# Altium project hardware.PrjPcb
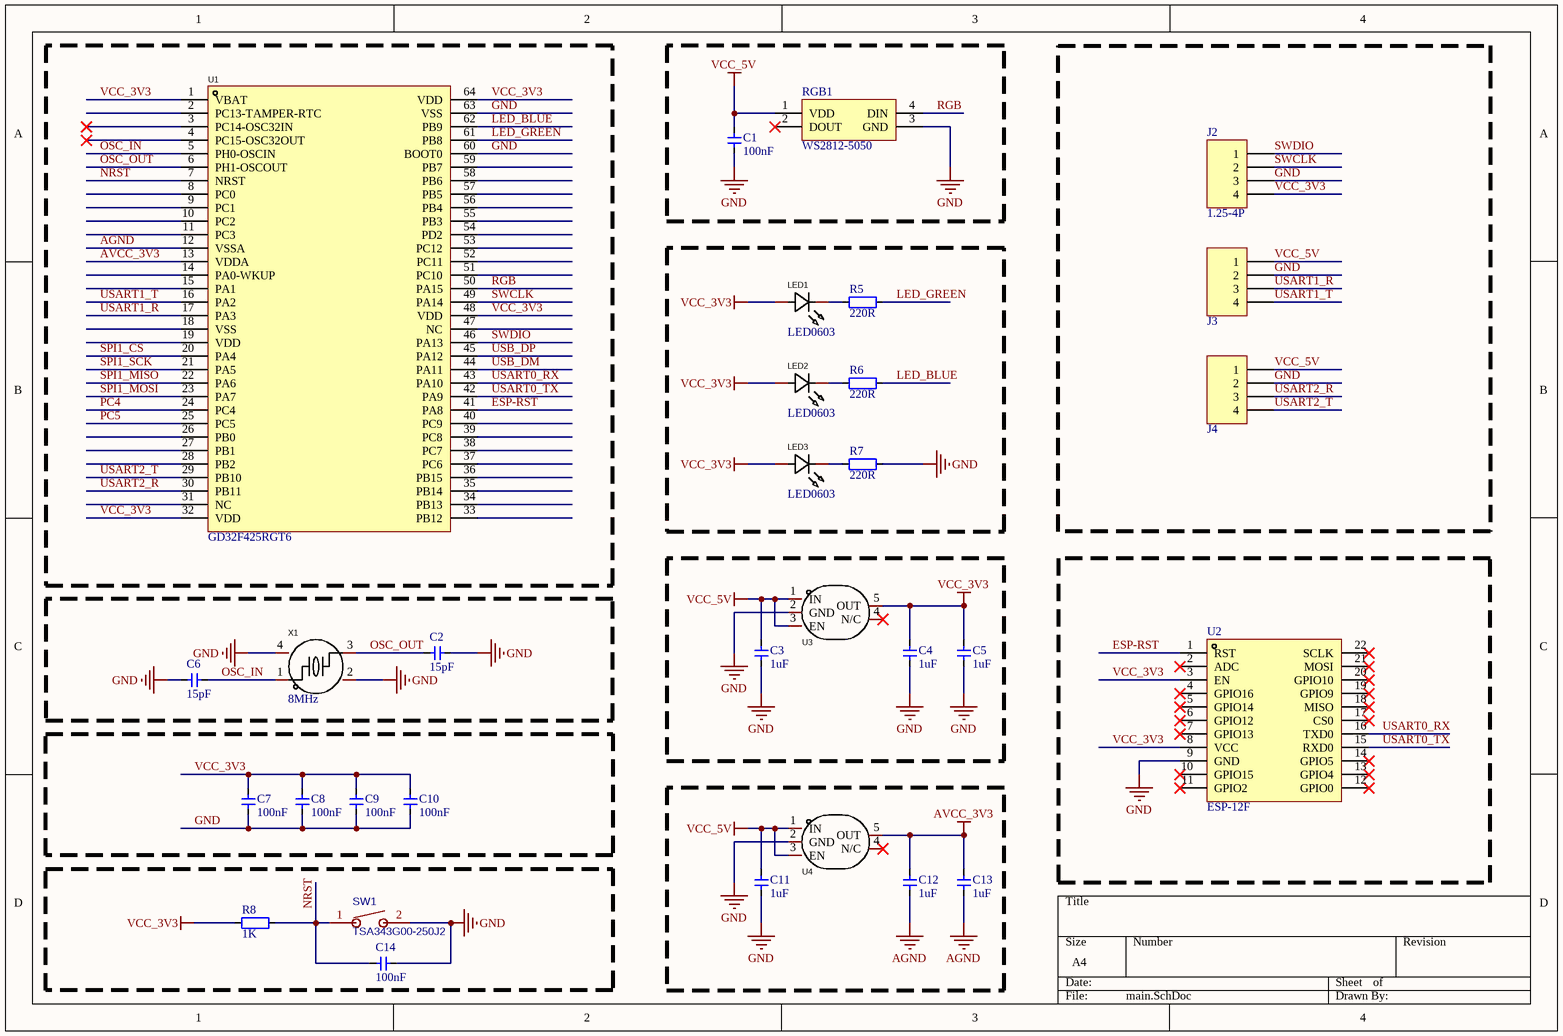
[diagram p0: main.SchDoc]
3 sheets, 65 parts. Net scope: global (net labels, ports and power ports of the same name join across sheets).
Board file: main.PcbDoc
Sheets:
  main.SchDoc
  interface.SchDoc
  w5500.SchDoc

## Sheet main.SchDoc
size A4

### Parts
C1  100nF  [C0603]
C2  15pF  [C0603]
C3  1uF  [C0603]
C4  1uF  [C0603]
C5  1uF  [C0603]
C6  15pF  [C0603]
C7  100nF  [C0603]
C8  100nF  [C0603]
C9  100nF  [C0603]
C10  100nF  [C0603]
C11  1uF  [C0603]
C12  1uF  [C0603]
C13  1uF  [C0603]
C14  100nF  [C0603]
J2  1.25-4P  [CONN-SMD_1.25-4PWT]
J3  GH1.25-W-4P  [CONN-SMD_4P-P1.25_X1251WRS-04HF-LPSW]  (value not drawn)
J4  GH1.25-W-4P  [CONN-SMD_4P-P1.25_X1251WRS-04HF-LPSW]  (value not drawn)
LED1  LED0603  [LED0603-BLUE]
LED2  LED0603  [LED0603-BLUE]
LED3  LED0603  [LED0603-BLUE]
R5  220R  [R0603]
R6  220R  [R0603]
R7  220R  [R0603]
R8  1K  [R0603]
RGB1  WS2812-5050  [LED-SMD_4P-L5.0-W5.0-TL_WS2812B-B]
SW1  TSA343G00-250J2  [SW-SMD_L4.0-W2.9-LS5.0]
U1  GD32F425RGT6  [LQFP-64_L10.0-W10.0-P0.50-LS12.0-BL - duplicate]
U2  ESP-12F  [WIFIM-SMD_ESP-12F-ESP8266MOD]
U3  LP5907  [SOT-23-5_L2.9-W1.6-P0.95-LS2.8-BR]  (value not drawn)
U4  LP5907  [SOT-23-5_L2.9-W1.6-P0.95-LS2.8-BR]  (value not drawn)
X1  8MHz  [CRYSTAL-SMD_4P-L3.2-W2.5-BL-1]

### Nets
AGND: C12.1 C13.1 U1.12(VSSA)
AVCC_3V3: C12.2 C13.2 U1.13(VDDA) U4.5(OUT)
GND: C1.1 C2.2 C3.1 C4.1 C5.1 C6.1 C7.1 C8.1 C9.1 C10.1 C11.1 C14.2 J2.3 J3.2 J4.2 R7.2 RGB1.3(GND) SW1.2 U1.60(BOOT0) U1.63(VSS) U2.9(GND) U3.2(GND) U4.2(GND) X1.2(GND) X1.4(GND)
VCC_3V3: C4.2 C5.2 C7.2 C8.2 C9.2 C10.2 J2.4 LED1.2(A) LED2.2(A) LED3.2(A) R8.1 U1.1(VBAT) U1.32(VDD) U1.48(VDD) U1.64(VDD) U2.3(EN) U2.8(VCC) U3.5(OUT)
VCC_5V: C1.2 C3.2 C11.2 J3.1 J4.1 RGB1.1(VDD) U3.1(IN) U3.3(EN) U4.1(IN) U4.3(EN)
ESP-RST: U1.41(PA8) U2.1(RST)
LED_BLUE: R6.2 U1.62(PB9)
LED_GREEN: R5.2 U1.61(PB8)
NRST: C14.1 R8.2 SW1.1 U1.7(NRST)
OSC_IN: C6.2 U1.5(PH0-OSCIN) X1.1
OSC_OUT: C2.1 U1.6(PH1-OSCOUT) X1.3
PC4: U1.24(PC4)
PC5: U1.25(PC5)
RGB: RGB1.4(DIN) U1.50(PA15)
SPI1_CS: U1.20(PA4)
SPI1_MISO: U1.22(PA6)
SPI1_MOSI: U1.23(PA7)
SPI1_SCK: U1.21(PA5)
SWCLK: J2.2 U1.49(PA14)
SWDIO: J2.1 U1.46(PA13)
USART0_RX: U1.43(PA10) U2.16(TXD0)
USART0_TX: U1.42(PA9) U2.15(RXD0)
USART1_R: J3.3 U1.17(PA3)
USART1_T: J3.4 U1.16(PA2)
USART2_R: J4.3 U1.30(PB11)
USART2_T: J4.4 U1.29(PB10)
USB_DM: U1.44(PA11)
USB_DP: U1.45(PA12)
NetLED1_1: LED1.1(K) R5.1
NetLED2_1: LED2.1(K) R6.1
NetLED3_1: LED3.1(K) R7.1

Not connected (* = marked no-connect by the designer): RGB1 2(DOUT)*; U1 2(PC13-TAMPER-RTC) 3(PC14-OSC32IN)* 4(PC15-OSC32OUT)* 8(PC0) 9(PC1) 10(PC2) 11(PC3) 14(PA0-WKUP) 15(PA1) 18(VSS) 19(VDD) 26(PB0) 27(PB1) 28(PB2) 31(NC) 33(PB12) 34(PB13) 35(PB14) 36(PB15) 37(PC6) 38(PC7) 39(PC8) 40(PC9) 47(NC) 51(PC10) 52(PC11) 53(PC12) 54(PD2) 55(PB3) 56(PB4) 57(PB5) 58(PB6) 59(PB7); U2 2(ADC)* 4(GPIO16)* 5(GPIO14)* 6(GPIO12)* 7(GPIO13)* 10(GPIO15)* 11(GPIO2)* 12(GPIO0)* 13(GPIO4)* 14(GPIO5)* 17(CS0)* 18(MISO)* 19(GPIO9)* 20(GPIO10)* 21(MOSI)* 22(SCLK)*; U3 4(N/C)*; U4 4(N/C)*

### Library data of the parts
C1-C14 = C0603
J2 = A1.25-4P
LED1-LED3 = LED0603: Manufacturer: VISHAY(威世); Name: VLMTG1401-GS08; Add into BOM: yes; Symbol: VLMTG1401-GS08; Device: VLMTG1401-GS08; LCSC Part Name: VLMTG1401-GS08; Supplier Part: C511604; Manufacturer Part: VLMTG1401-GS08; Supplier Footprint: 0603; JLCPCB Part Class: Extended Part; Datasheet: https://atta.szlcsc.com/upload/public/pdf/source/20200413/C511604_272E80EA2E53340B96FA7453D68B4387.pdf; Supplier: LCSC; Convert to PCB: yes; Mounting Type: -; Illumination Color: -; Lens Color: -; Correlated Color Temperature - CCT(K): -; Luminous Intensity (IF=20mA): -; Luminous Flux/Radiant Flux: -; Color Rendering Index(CRI): -; Dominant Wavelength / Coordinate rank: -; Vf - Forward Voltage: -; Size / Dimension: -; Operating Temperature: -; Height (Max): -
R5-R8 = R0603
SW1 = TSA343G00-250J2: 贴片轻触开关; BOM_Manufacturer: BRIGHT; Contributor: LCSC; BOM_Supplier: LCSC; BOM_Supplier Part: C354946; BOM_Manufacturer Part: TSA343G00-250J2; spicePre: S; spiceSymbolName: TSA343G00-250J2
U1 = GD32F425RGT6: Manufacturer: GigaDevice(兆易创新); Symbol: GD32F425RGT6_C5110337; Add into BOM: yes; CPU Core: ARM Cortex-M4; CPU Maximum Speed: 200MHz; Program Storage Size: 1MB; Program Memory Type: FLASH; RAM Size: 256KB; GPIO Ports Number: 51; ADC (Bit): 12bit; 16Bit Timer: 12; 32Bit Timer: 2; UART/USART: 6; I2C: 3; Universal Serial Bus: 有; Peripheral/Function: 看门狗；SDIO；RTC实时时钟; Name: GD32F425RGT6; Device: GD32F425RGT6_C5110337; LCSC Part Name: ARM Cortex-M4 200MHz; Supplier Part: C5110337; Manufacturer Part: GD32F425RGT6; Supplier Footprint: LQFP-64(10x10); JLCPCB Part Class: Extended Part; Datasheet: https://atta.szlcsc.com/upload/public/pdf/source/20220714/13D48AB36408F15A7501F309CB28955F.pdf; Supplier: LCSC; Convert to PCB: yes; Operating Voltage Range: -; EEPROM: -; DAC (Bit): 12bit; PWM (Bit): -; 8Bit Timer: -; CAN: 2; I2S: 2; SPI: 3; Internal Comparator: -; communication protocol: -; Watchdog: 有; Real-Time Clock: 有; Infrared Data Association: -; Low-Voltage Detect: -; CCP Capture/Compare: -; Secure Digital Input and Output: 有; Direct Memory Access: -; Internal Oscillator: -; Operating Temperature Range: -
U3 U4 = LP5907: Manufacturer: TI(德州仪器); Name: LP5907MFX-3.2/NOPB; Add into BOM: yes; Symbol: LP5907MFX-3.2/NOPB; Device: LP5907MFX-3.2/NOPB; LCSC Part Name: LP5907MFX-3.2/NOPB; Supplier Part: C2832238; Manufacturer Part: LP5907MFX-3.2/NOPB; Supplier Footprint: SOT-23-5; JLCPCB Part Class: Extended Part; Datasheet: https://atta.szlcsc.com/upload/public/pdf/source/20230221/5933F7A77801C34991E6DC8A51DC8D54.pdf; Supplier: LCSC; Convert to PCB: yes; Output Type: -
X1 = 8Mhz: Manufacturer: CJ(江苏长电/长晶); Symbol: CJ13-080001210C30; Add into BOM: yes; Load Capacitance: 12pF; Name: 8MHz; Device: CJ13-080001210C30; LCSC Part Name: 8MHz 12pF; Supplier Part: C2875275; Manufacturer Part: CJ13-080001210C30; Supplier Footprint: SMD3225-4P; JLCPCB Part Class: Extended Part; Datasheet: https://atta.szlcsc.com/upload/public/pdf/source/20211013/0FAD337EB33B5BE9D660099A731DCCD1.pdf; Supplier: LCSC; Convert to PCB: yes; Value: 8MHz

## Sheet interface.SchDoc
size A4
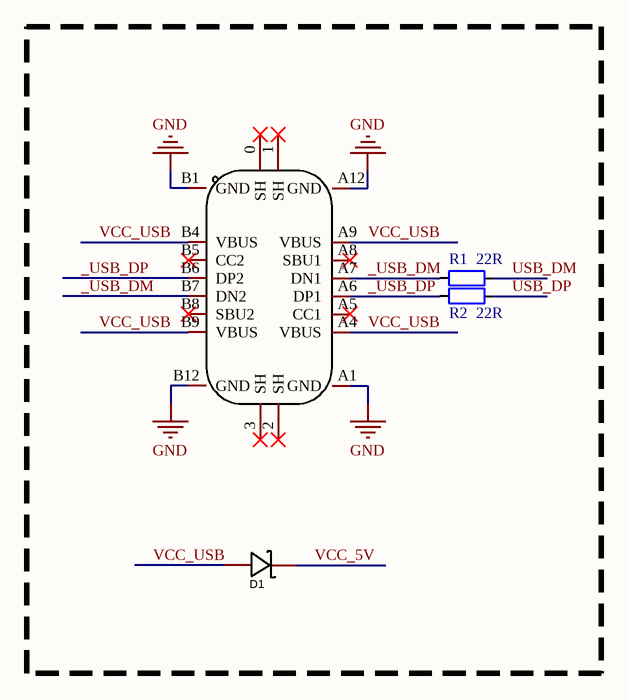
[diagram p1: interface.SchDoc]

### Parts
D1  B5819WS  [SOD-323_L1.8-W1.3-LS2.5-RD]  (value not drawn)
R1  22R  [R0603]
R2  22R  [R0603]
USBC1  TYPE-C-31-M-12  [Type-C-TOP]  (value not drawn)

### Nets
GND: USBC1.A1(GND) USBC1.A12(GND) USBC1.B1(GND) USBC1.B12(GND)
VCC_5V: D1.1(K)
_USB_DM: R1.1 USBC1.A7(DN1) USBC1.B7(DN2)
_USB_DP: R2.1 USBC1.A6(DP1) USBC1.B6(DP2)
USB_DM: R1.2
USB_DP: R2.2
VCC_USB: D1.2(A) USBC1.A4(VBUS) USBC1.A9(VBUS) USBC1.B4(VBUS) USBC1.B9(VBUS)

Not connected (* = marked no-connect by the designer): USBC1 0(SH)* 1(SH)* 2(SH)* 3(SH)* A5(CC1)* A8(SBU1)* B5(CC2)* B8(SBU2)*

### Library data of the parts
D1 = B5819WS: Manufacturer: CJ(江苏长电/长晶); Symbol: B5819WS_C22624; Add into BOM: yes; Reverse Voltage (Vr): 40V; Average Rectified Current (Io): 1A; Forward Voltage (Vf@If): 600mV@1A; Name: B5819WS; Device: B5819WS_C22624; LCSC Part Name: 40V 1A 600mV@1A; Supplier Part: C22624; Manufacturer Part: B5819WS; Supplier Footprint: SOD-323; JLCPCB Part Class: Extended Part; Datasheet: https://atta.szlcsc.com/upload/public/pdf/source/20170919/C22624_1505799673448977596.pdf; Supplier: LCSC; Convert to PCB: yes
R1 R2 = R0603
USBC1 = TYPE-C-31-M-12: Manufacturer: 韩国韩荣; Add into BOM: yes; Connector Type: Type-C; Gender: 母座; Number of Contacts: 16; Number of Ports: 1; Current Rating - Power (Max): 5A; Name: TYPE-C-31-M-12; Symbol: TYPE-C-31-M-12; Device: TYPE-C-31-M-12; LCSC Part Name: Type-C 母座; Supplier Part: C165948; Manufacturer Part: TYPE-C-31-M-12; Supplier Footprint: SMD; JLCPCB Part Class: Extended Part; Datasheet: https://atta.szlcsc.com/upload/public/pdf/source/20220525/466408E853115E789EDB0DDC29077C05.pdf; Supplier: LCSC; Convert to PCB: yes; Standard: -; Mounting Style: -; Contact Material: -; Contact Plating: -; Operating Temperature Range: -; Welding Temperature (Max): -

## Sheet w5500.SchDoc
size A4
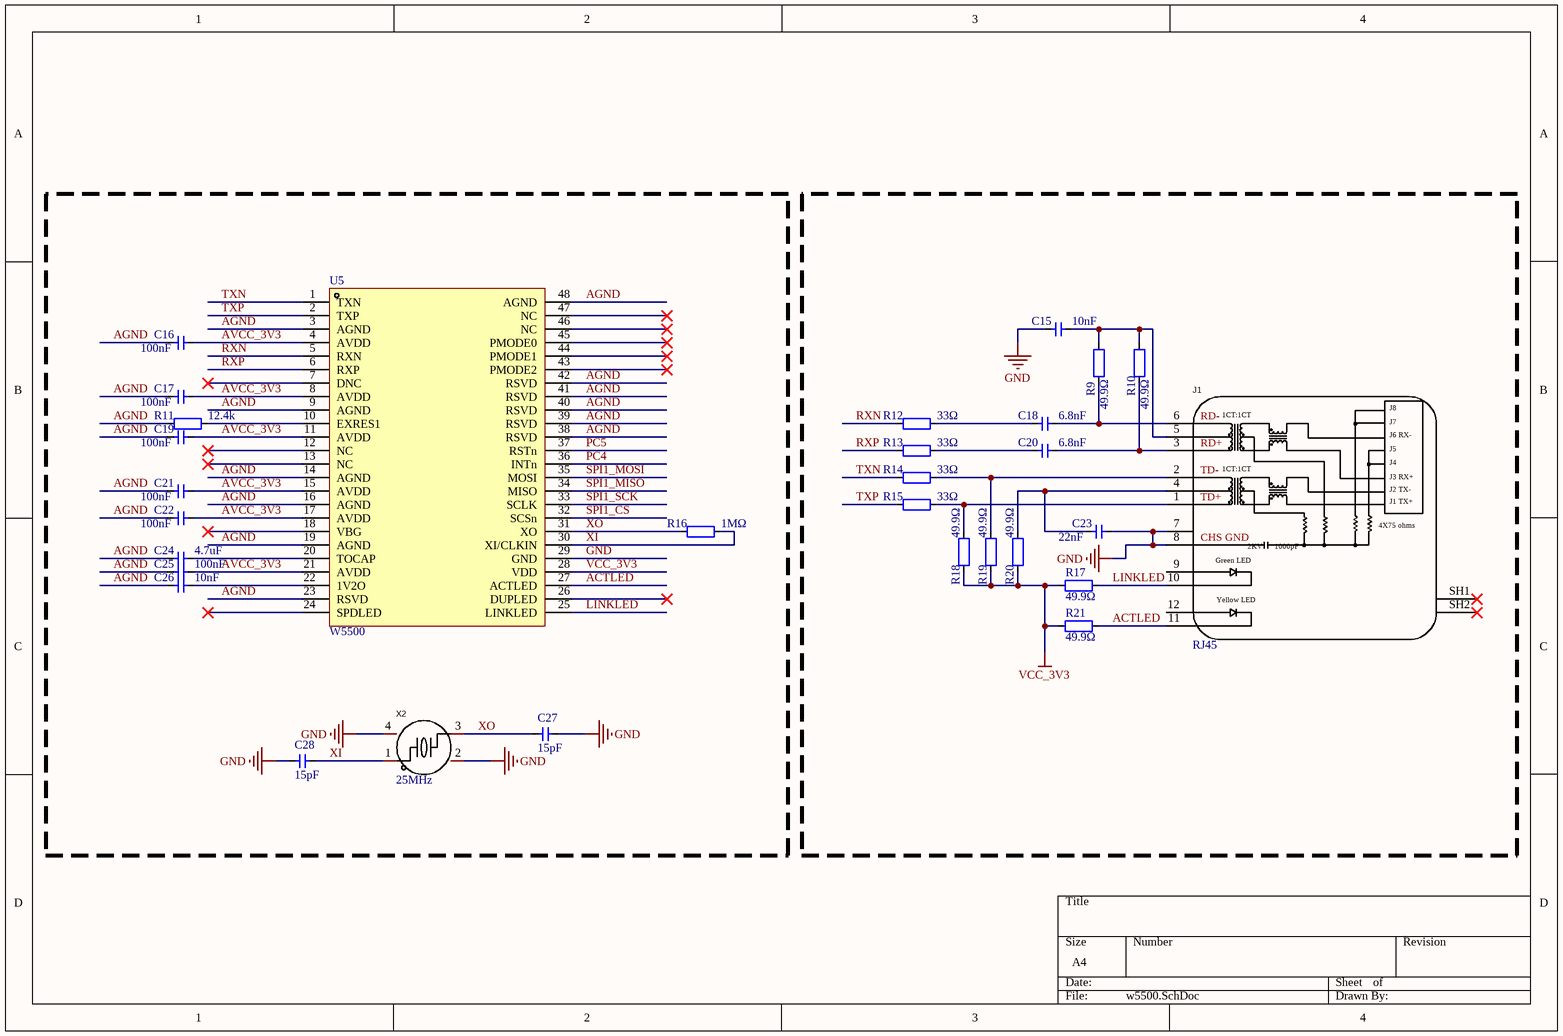
[diagram p2: w5500.SchDoc]

### Parts
C15  10nF  [C0603]
C16  100nF  [C0603]
C17  100nF  [C0603]
C18  6.8nF  [C0603]
C19  100nF  [C0603]
C20  6.8nF  [C0603]
C21  100nF  [C0603]
C22  100nF  [C0603]
C23  22nF  [C0603]
C24  4.7uF  [C0603]
C25  100nF  [C0603]
C26  10nF  [C0603]
C27  15pF  [C0603]
C28  15pF  [C0603]
J1  RJ45  [RJ45-TH_HR911105A]
R9  49.9Ω  [R0603]
R10  49.9Ω  [R0603]
R11  12.4k  [R0603]
R12  33Ω  [R0603]
R13  33Ω  [R0603]
R14  33Ω  [R0603]
R15  33Ω  [R0603]
R16  1MΩ  [R0603]
R17  49.9Ω  [R0603]
R18  49.9Ω  [R0603]
R19  49.9Ω  [R0603]
R20  49.9Ω  [R0603]
R21  49.9Ω  [R0603]
U5  W5500  [LQFP-48_L7.0-W7.0-P0.50-LS9.0-BL]
X2  25MHz  [CRYSTAL-SMD_4P-L3.2-W2.5-BL-1]

### Nets
AGND: C16.1 C17.1 C19.1 C21.1 C22.1 C24.1 C25.1 C26.1 R11.1 U5.3(AGND) U5.9(AGND) U5.14(AGND) U5.16(AGND) U5.19(AGND) U5.23(RSVD) U5.38(RSVD) U5.39(RSVD) U5.40(RSVD) U5.41(RSVD) U5.42(RSVD) U5.48(AGND)
AVCC_3V3: C16.2 C17.2 C19.2 C21.2 C22.2 C25.2 U5.4(AVDD) U5.8(AVDD) U5.11(AVDD) U5.15(AVDD) U5.17(AVDD) U5.21(AVDD)
GND: C15.1 C23.2 C27.2 C28.1 J1.7 J1.8 U5.29(GND) X2.2(GND) X2.4(GND)
VCC_3V3: R17.2 R18.2 R19.2 R20.2 R21.2 U5.28(VDD)
ACTLED: J1.11 R21.1 U5.27(ACTLED)
LINKLED: J1.10 R17.1 U5.25(LINKLED)
PC4: U5.36(INTn)
PC5: U5.37(RSTn)
RXN: R12.1 U5.5(RXN)
RXP: R13.1 U5.6(RXP)
SPI1_CS: U5.32(SCSn)
SPI1_MISO: U5.34(MISO)
SPI1_MOSI: U5.35(MOSI)
SPI1_SCK: U5.33(SCLK)
TXN: R14.1 U5.1(TXN)
TXP: R15.1 U5.2(TXP)
XI: C28.2 R16.2 U5.30(XI/CLKIN) X2.1
XO: C27.1 R16.1 U5.31(XO) X2.3
NetC15_2: C15.2 J1.5 R9.2 R10.2
NetC18_1: C18.1 R12.2
NetC18_2: C18.2 J1.6 R9.1
NetC20_1: C20.1 R13.2
NetC20_2: C20.2 J1.3 R10.1
NetC23_1: C23.1 J1.4 R20.1
NetC24_2: C24.2 U5.20(TOCAP)
NetC26_2: C26.2 U5.22(1V2O)
NetJ1_1: J1.1 R15.2 R18.1
NetJ1_2: J1.2 R14.2 R19.1
NetR11_2: R11.2 U5.10(EXRES1)

Not connected (* = marked no-connect by the designer): J1 9 12 SH1* SH2*; U5 7(DNC)* 12(NC)* 13(NC)* 18(VBG)* 24(SPDLED)* 26(DUPLED)* 43(PMODE2)* 44(PMODE1)* 45(PMODE0)* 46(NC)* 47(NC)*

### Notes on the sheet
- (in symbol RJ45) J8; RD-; 1CT:1CT; J7; J6 RX-; RD+; J5; J4; TD-; J3 RX+; J2 TX-; TD+; J1 TX+; 4X75 ohms; CHS GND; 2KV; 1000pF; Green LED; Yellow LED

### Library data of the parts
C15-C28 = C0603
J1 = RJ45: Manufacturer: HANRUN(汉仁); Name: HR911105A; Symbol: HR911105A_C12074; Add into BOM: yes; Connector Type: RJ插座; Number of Ports: 1; LED: 带LED; Device: HR911105A_C12074; LCSC Part Name: RJ45 带LED 带LED灯; Supplier Part: C12074; Manufacturer Part: HR911105A; Supplier Footprint: 插件; JLCPCB Part Class: Extended Part; Datasheet: https://atta.szlcsc.com/upload/public/pdf/source/20170918/C12074_1505726819496976146.pdf; Supplier: LCSC; Convert to PCB: yes; USOC Codes: RJ45; Ratings: -; Shielding: -
R9-R21 = R0603
X2 = 8Mhz: Manufacturer: CJ(江苏长电/长晶); Symbol: CJ13-080001210C30; Add into BOM: yes; Value: 8MHz; Load Capacitance: 12pF; Name: 8MHz; Device: CJ13-080001210C30; LCSC Part Name: 8MHz 12pF; Supplier Part: C2875275; Manufacturer Part: CJ13-080001210C30; Supplier Footprint: SMD3225-4P; JLCPCB Part Class: Extended Part; Datasheet: https://atta.szlcsc.com/upload/public/pdf/source/20211013/0FAD337EB33B5BE9D660099A731DCCD1.pdf; Supplier: LCSC; Convert to PCB: yes

## Nets that join several sheets
AGND: main (C12.1 C13.1 U1.12), w5500 (21 pins)
AVCC_3V3: main (C12.2 C13.2 U1.13 U4.5), w5500 (12 pins)
GND: main (25 pins), interface (USBC1.A1 USBC1.A12 USBC1.B1 USBC1.B12), w5500 (9 pins)
VCC_3V3: main (18 pins), w5500 (6 pins)
VCC_5V: main (10 pins), interface (D1.1)
PC4: main (U1.24), w5500 (U5.36)
PC5: main (U1.25), w5500 (U5.37)
SPI1_CS: main (U1.20), w5500 (U5.32)
SPI1_MISO: main (U1.22), w5500 (U5.34)
SPI1_MOSI: main (U1.23), w5500 (U5.35)
SPI1_SCK: main (U1.21), w5500 (U5.33)
USB_DM: main (U1.44), interface (R1.2)
USB_DP: main (U1.45), interface (R2.2)